# EAGLE design 555timer pwm (EAGLE 9.6.2)
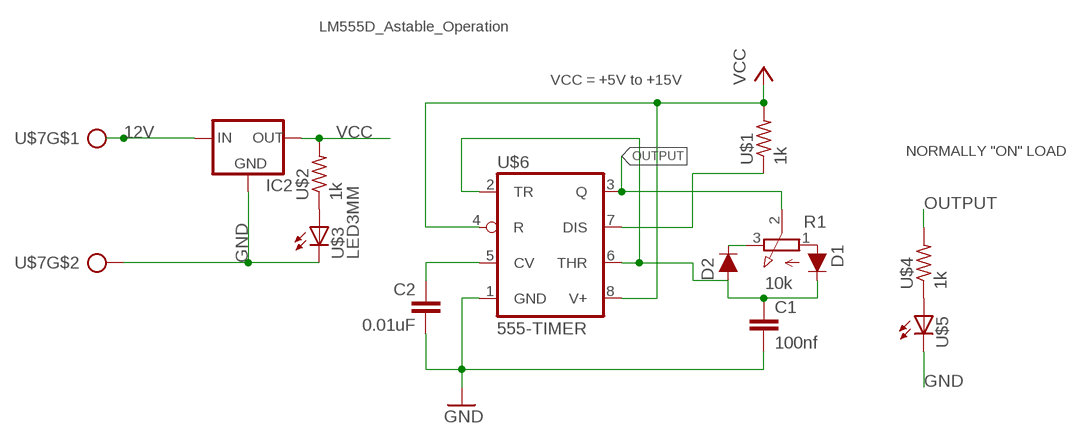
[diagram p0: schematic, sheet 1]

## Parts
C1  100nf  CAPACITOR  [C025-025X050]
C2  0.01uF  CAPACITOR  [C025-025X050]
D1  200mA/100V/1V  DIODE(1A)-1N4148  [DIODE-1N4148]
D2  200mA/100V/1V  DIODE(1A)-1N4148  [DIODE-1N4148]
IC2  78XXS  [78XXS]
R1  10k  POTENTIOMETER  [3RP/1610N]
U$1  1k  RES-5  [0204/5]
U$2  1k  RES-5  [0204/5]
U$3  LED3MM  [LED3MM]
U$4  1k  RES-5  [0204/5]
U$5  LED3MM  [LED3MM]
U$6  555-TIMER  [DIL08]
U$7  CON_PTR_2  [AK300/2]

## Nets
12V: IC2.IN U$7.1
GND: C1.2 C2.2 IC2.GND U$3.K(C) U$5.K(C) U$6.1(GND) U$7.2
N$2: D1.A R1.1(A)
N$3: C1.1 D1.C D2.A U$6.2(TR) U$6.6(THR)
N$4: C2.1 U$6.5(CV)
N$5: D2.C R1.3(E)
N$6: U$2.1 U$3.A
N$7: U$4.1 U$5.A
N$8: U$1.1 U$6.7(DIS)
OUTPUT: R1.2(S) U$4.2 U$6.3(Q)
VCC: IC2.OUT U$1.2 U$2.2 U$6.4(R) U$6.8(V+)

## Notes on the sheet
- LM555D_Astable_Operation
- VCC = +5V to +15V
- NORMALLY "ON" LOAD

## Library data of the parts
C1 C2 = MIA_LIBRARY-2-2-2:CAPACITOR
D1 D2 = MIA_LIBRARY-2-2-2:DIODE(1A): Diode These are standard reverse protection diodes and small signal diodes. SparkFun Products: SparkFun SparkPunk Sound Kit <https://www.sparkfun.com/products/11177> SparkFun ESP8266 Thing <https://www.sparkfun.com/products/13231>; PROD_ID: DIO-08378
IC2 = v-reg:78XXS: VOLTAGE REGULATOR
R1 = MIA_LIBRARY-2-2-2:POTENTIOMETER: 16mm Potentiometer one level Source: http://www.alphapotentiometers.net/html/16mm_pot_2.html
U$1 U$2 U$4 = MIA_LIBRARY-2-2-2:RES-5
U$3 U$5 = MIA_LIBRARY-2-2-2:LED3MM
U$6 = MIA_LIBRARY-2-2-2:555-TIMER
U$7 = MIA_LIBRARY-2-2-2:CON_PTR_2

## Board
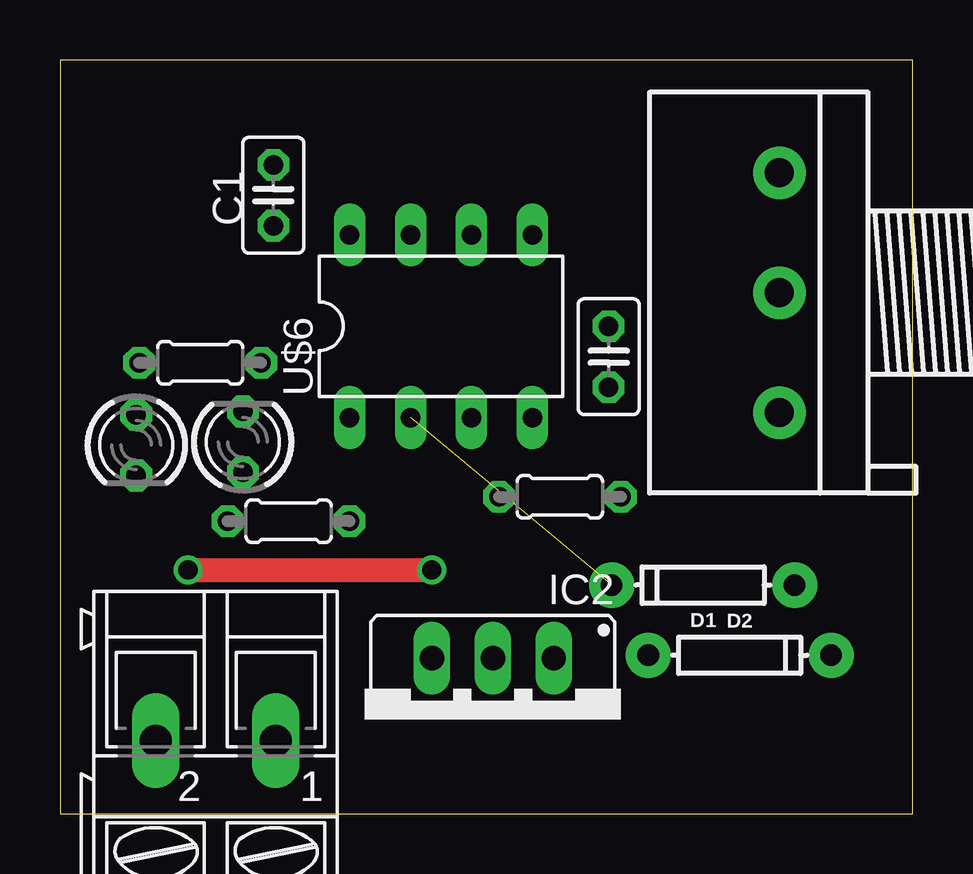
[diagram p1: board, top side]
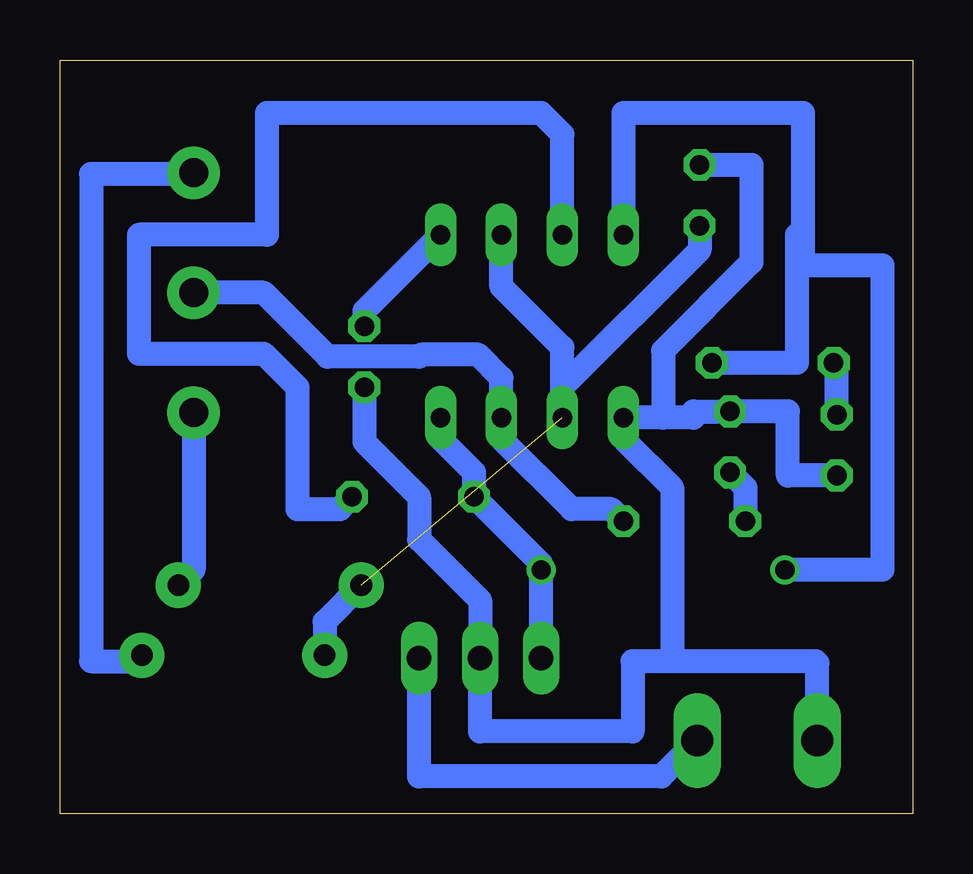
[diagram p2: board, bottom side, seen from below]

Size 35.54 x 31.42 mm. Coordinates in mm from the lower left corner, seen from the top.
Outline: 0,0 35.54,0 35.54,31.42 0,31.42 0,0
Copper layers (1*16): Top 0.035mm / dielectric 1.5mm / Bottom 0.035mm
Design rules "default *": minimum track width 1mm, minimum drill 0.35mm, track to track 0.8mm, track to pad 0.8mm, pad to pad 0.8mm, via to via 0.8mm, smd to smd 6mil, copper to edge 0.8mm, drill to drill 0.8mm, minimum pad ring 10mil, minimum via ring 8mil, stop-mask expansion 4mil, vias tented up to drill 0mil, thermal gap 10mil

### Footprints (pad centres in the part's own frame; a part is rotated, then mirrored left to right if it is on the bottom)
C025-025X050 = drill 0.813 octagon: 1 -1.27,0; 2 1.27,0
DIODE-1N4148 = drill 0.9 pad 1.88: A -3.81,0; C 3.81,0
78XXS = drill 1.016 long: GND 0,-2.54; IN -2.54,-2.54; OUT 2.54,-2.54
3RP/1610N = drill 1.2 pad 2.184: 1 -5,0; 2 0,0; 3 5,0
0204/5 = drill 0.813 octagon: 1 -2.54,0; 2 2.54,0
LED3MM = drill 0.813 octagon: A -1.27,0; K 1.27,0
DIL08 = drill 0.813 long: 1 -3.81,-3.81; 2 -1.27,-3.81; 3 1.27,-3.81; 4 3.81,-3.81; 5 3.81,3.81; 6 1.27,3.81; 7 -1.27,3.81; 8 -3.81,3.81
AK300/2 = drill 1.321 long: 1 -2.515,0; 2 2.489,0

### Placement (x,y rotation side)
C1  8.89,25.78 90 top
C2  22.86,19.05 270 top
D1  26.8,9.53 180 top
D2  28.32,6.6 0 top
IC2  18.03,3.94 180 top
R1  29.97,21.72 90 top
U$1  20.83,13.21 180 top
U$2  5.84,18.8 0 top
U$3  3.17,15.37 270 top
U$4  9.53,12.19 0 top
U$5  7.62,15.49 90 top
U$6  15.87,20.32 0 top
U$7  6.48,3.05 180 top

### Tracks (layer width: path | path; a pad name or v marks a point on that pad's centre or on a via)
12V
  Bottom 1: U$7.1 10.49,1.55 20.57,1.55 IC2.IN
GND
  Bottom 1: U$7.2 3.99,6.27 4.06,6.35 10.03,6.35 | 10.03,6.35 11.68,6.35 11.68,3.43 18.03,3.43 IC2.GND 18.03,8.89 20.57,11.43 20.57,13.21 22.86,15.49 C2.2 | 10.03,6.35 10.03,13.59 12.06,15.62 U$6.1 10.41,16.51 | U$3.K 5.21,14.1 5.21,16.76 U$5.K 9.14,16.76 9.14,16.51 10.41,16.51 | C1.2 6.73,27.05 6.73,22.99 10.41,19.3 10.41,16.51
N$2
  Bottom 1: R1.1 29.97,10.16 D1.A
N$3  (1 unrouted)
  Bottom 1: 23.24,9.78 D1.C 24.51,8 D2.A | U$6.6 17.15,21.97 14.61,19.43 U$6.2 14.61,17.78 8.89,23.5 C1.1
N$4
  Bottom 1: C2.1 22.86,20.95 U$6.5
N$5
  Bottom 1: R1.3 30.02,26.67 34.24,26.67 34.24,6.35 32.39,6.35 D2.C
N$6
  Bottom 1: U$3.A 3.17,18.67 U$2.1
N$7
  Bottom 1: U$5.A 6.98,13.59 U$4.1
N$8
  Bottom 1: U$6.7 14.61,28.32 15.49,29.21 26.92,29.21 26.92,24.13 32.26,24.13 32.26,19.18 27.05,19.18 25.65,17.78 25.65,12.7 23.88,12.7 U$1.1
OUTPUT
  Bottom 1: U$4.2 12.57,12.7 14.22,12.7 17.15,15.62 U$6.3 17.15,18.16 18.12,19.13 20.5,19.13 20.58,19.05 24.38,19.05 27.05,21.72 R1.2
VCC  (via drill 0.8)
  Top 1: v5.33,10.16 v15.49,10.16
  Bottom 1: IC2.OUT v15.49,10.16 15.49,10.41 U$1.2 18.29,14.22 19.69,15.62 U$6.4 | U$2.2 4.83,18.8 4.83,24.13 4.57,24.13 | U$6.8 12.06,29.21 4.57,29.21 4.57,24.13 | 4.57,24.13 4.57,22.86 1.27,22.86 1.27,10.16 v5.33,10.16

### Text on the board
tPlace: Ton = 0.7*(R1+Rx)*C | Toff = 0.7*(Ry)*C | T= 0.7*(R1+Rx+Ry)*C=0.7*(R1+Pot)*C | F= 1/T | DutyCycle= Ton/T